# Altium project Optic_sensor.PrjPcb
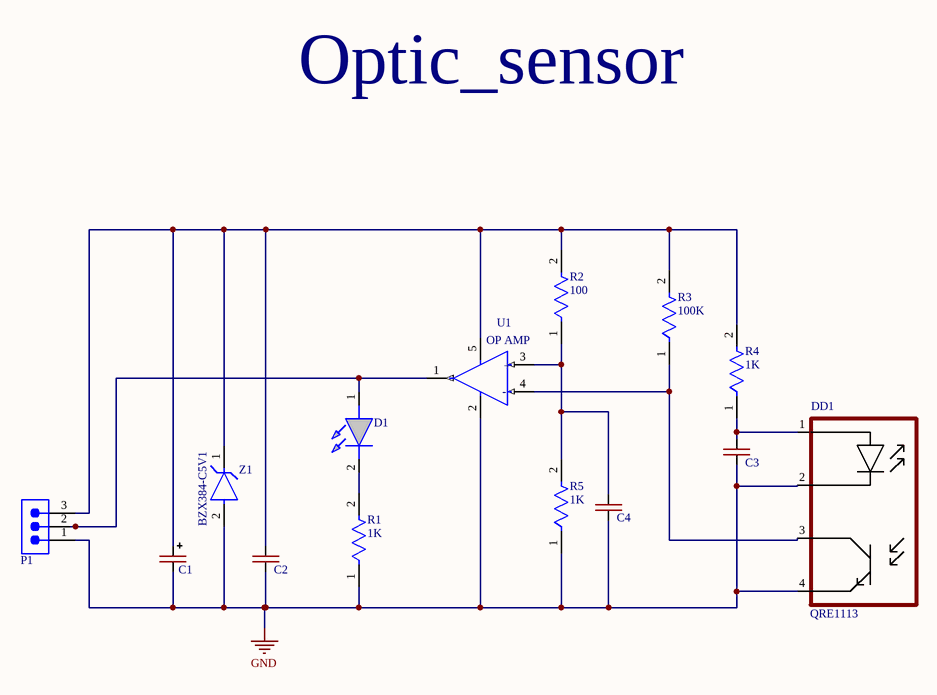
[diagram p0: Optic_sensor.SchDoc]
1 sheet, 14 parts. Net scope: global (net labels, ports and power ports of the same name join across sheets).
Board file: Optic_sensor.PcbDoc

## Sheet Optic_sensor.SchDoc
size A3; SheetNumber: 1; SheetTotal: 1

### Parts
C1  CAP-POLAR  [CAP-TAN-C]  (value not drawn)
C2  CAP-NON-POLAR  [CAP-0805]  (value not drawn)
C3  CAP-NON-POLAR  [CAP-0805]  (value not drawn)
C4  CAP-NON-POLAR  [CAP-0805]  (value not drawn)
D1  151031YS06000  [LED_RED]  (value not drawn)
DD1  QRE1113  [QRE1113]
P1  61900311121  [61900311121]  (value not drawn)
R1  1K  [RES-0805]
R2  100  [RES-0805]
R3  100K  [RES-0805]
R4  1K  [RES-0805]
R5  1K  [RES-0805]
U1  OP AMP  [SOT-23-5]
Z1  BZX384-C5V1  [BZX384-SOD323-IPC_C]

### Nets
GND: C1.2(-) C2.1 C3.1 C4.1 DD1.2(CATHODE) DD1.4 P1.1 R1.1 R5.1 U1.2(VSS) Z1.2(A)
NetC1_1: C1.1(+) C2.2 P1.3 R2.2 R3.2 R4.2 U1.5(VDD) Z1.1(C)
NetC3_2: C3.2 DD1.1(ANODE) R4.1
NetC4_2: C4.2 R2.1 R5.2 U1.3(VIN+)
NetD1_1: D1.1(A) P1.2 U1.1(VOUT)
NetD1_2: D1.2(K) R1.2
NetDD1_3: DD1.3 R3.1 U1.4(VIN-)

### Notes on the sheet
- Optic_sensor
- (in symbol MCP6001T) +; -

### Library data of the parts
D1 = LED: WURTH ELEKTRONIK - 151031YS06000 - LED, Yellow, Through Hole, T-1 (3mm), 30 mA, 2 V, 590 nm; Geometry.Height: 5.5mm; Manufacturer_Name: Wurth Elektronik; Manufacturer_Part_Number: 151031YS06000; Mouser Part Number: 710-151031YS06000; Mouser Price/Stock: https://www.mouser.co.uk/ProductDetail/Wurth-Elektronik/151031YS06000?qs=LlUlMxKIyB3xSYYW%252BcuBiQ%3D%3D; Arrow Part Number: *; Arrow Price/Stock: *; Mouser Testing Part Number: *; Mouser Testing Price/Stock: *; Datasheet Link: https://katalog.we-online.de/led/datasheet/151031YS06000.pdf
P1 = 61900311121: WR-WTB THT Male Vertical Locking Header, pitch 2.54mm, 3pins; Manufacturer: Wurth Elektronik; Contact Resistance: 20mΩ; Rated Current: 3A; Working Voltage: 250VAC; Withstanding Voltage: 1000VAC; ComponentLink1Description: Website Link; ComponentLink1URL: https://www.we-online.com/redexpert/article/61900311121?ad; ComponentLink2Description: Datasheet Link; ComponentLink2URL: https://www.we-online.com/redexpert/spec/61900311121?ad; Manufacturer Part Number: 61900311121; Category: Wire-to-Board Connectors; Match Code: WR-WTB; Mount: Through Hole; Operating Temperature Max: 105°C; Operating Temperature Min: -40°C; Packaging: Bag; Length: 7.62mm; Width: 5.8mm; Height: 11.5mm; Gender: Male; Number of Pins: 3; Number of Rows: 1; Orientation: Vertical; Pitch: 2.54mm
R1-R5 = RES-CONST
U1 = MCP6001T